# EAGLE design final (EAGLE 9.6.2)
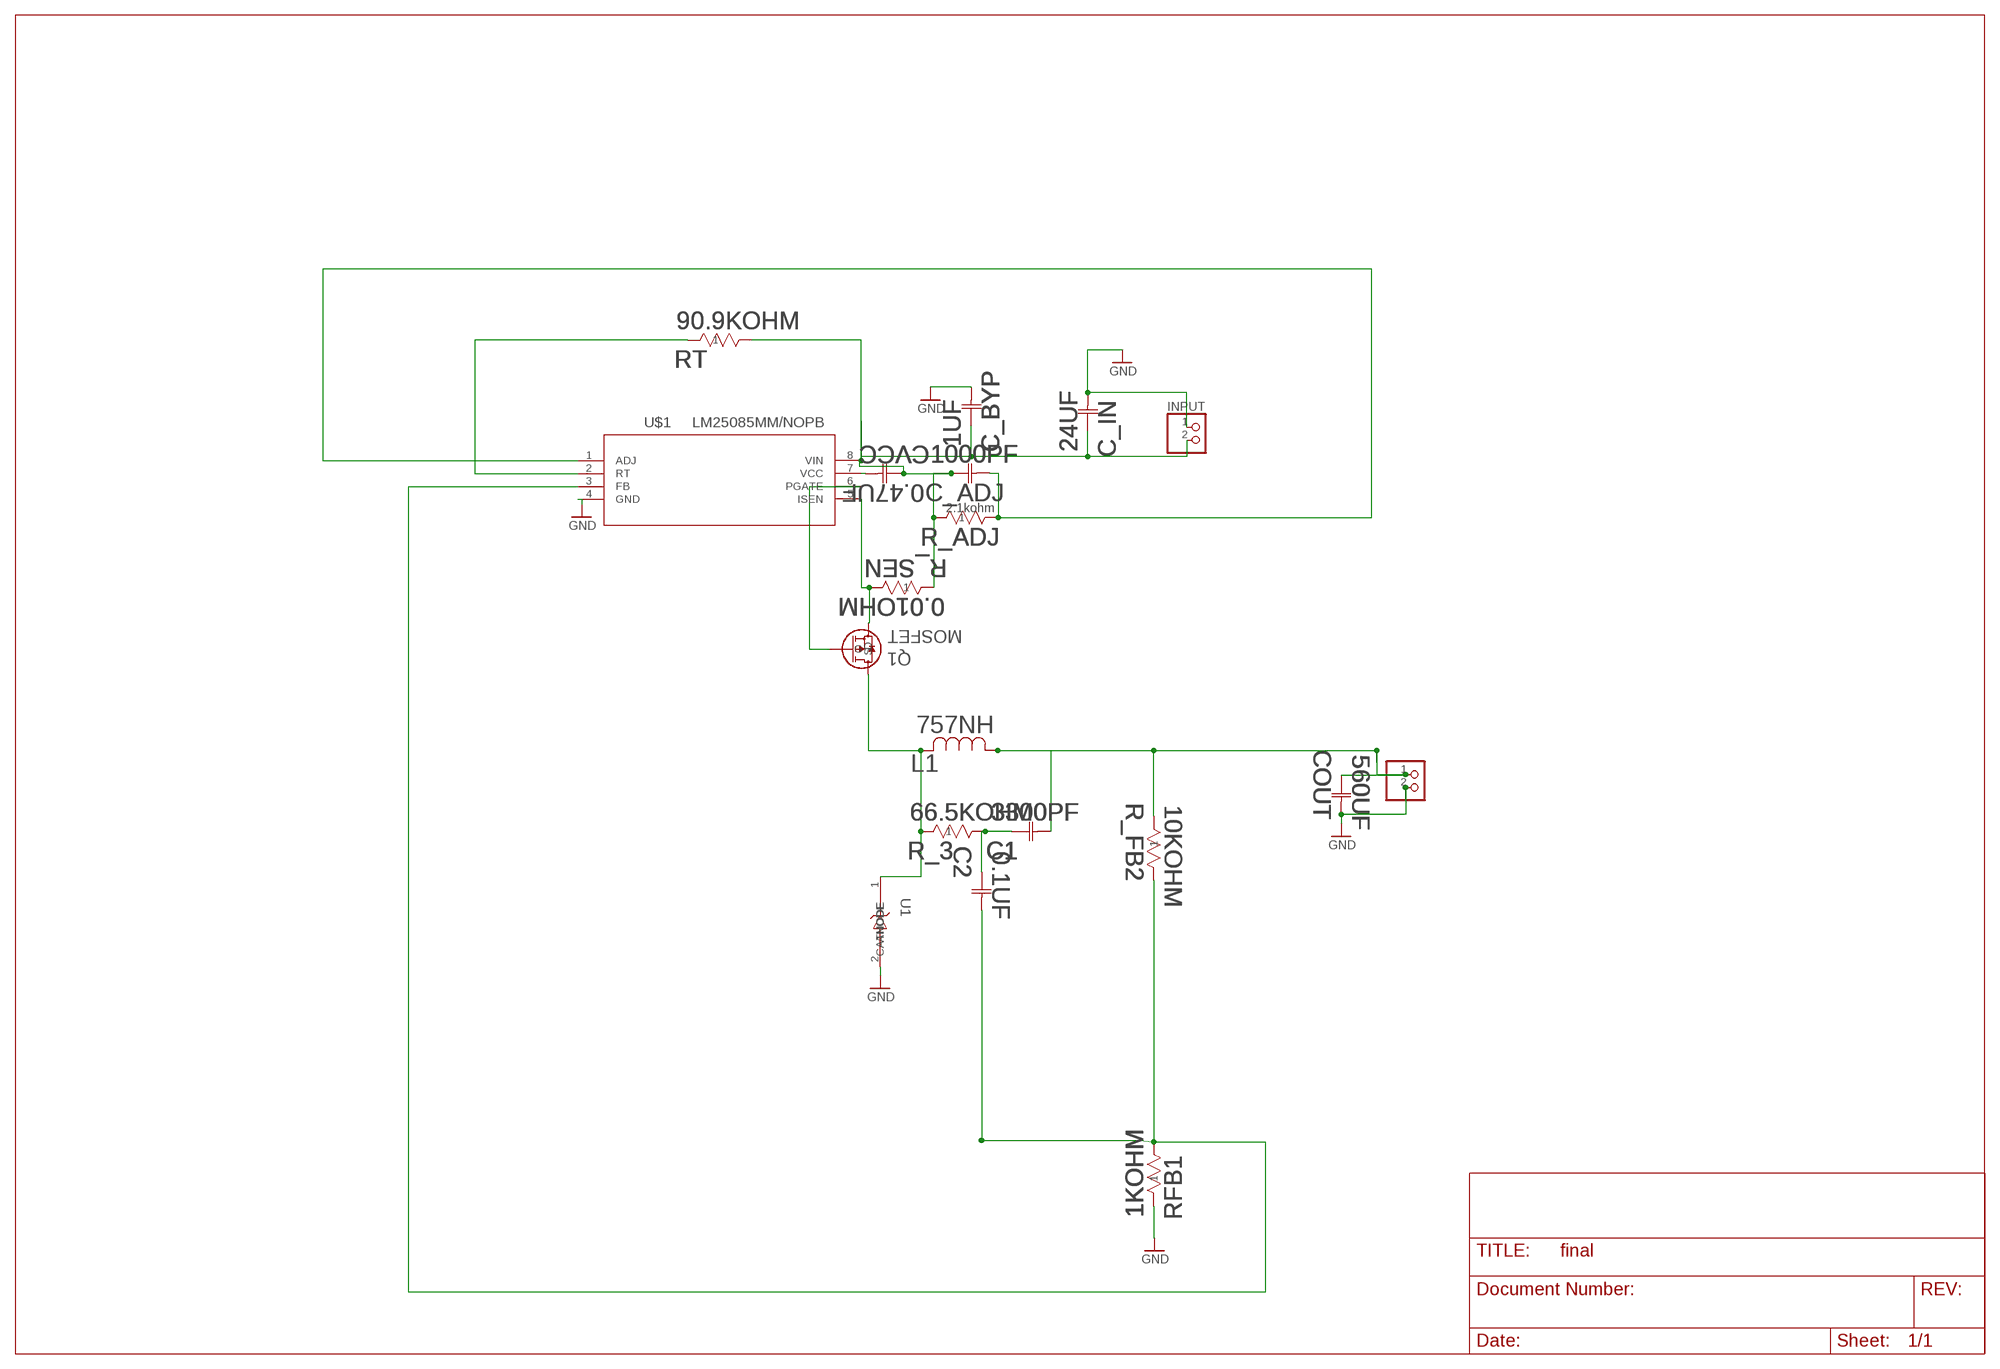
[diagram p0: schematic, sheet 1]

## Parts
0.01OHM  R_SEN  [STA_MPR5_STP]
0.1UF  C2  [U2-D_NCH]
0.47UF  CVCC  [CAP_WCAP-ATG8_05.0X11.0_WRE]
1KOHM  RFB1  [STA_CF14_STP]
1UF  C_BYP  [CAP_FG26_TDK]
2.1KOHM  R_ADJ  [STA_RNF14_STP]
10KOHM  R_FB2  [STA_CF14_STP]
24UF  C_IN  [CAP_5X11_WRE]
66.5KOHM  R_3  [RES_CMF50_VIS]
90.9KOHM  RT  [YAG_MF25_YAG]
560UF  COUT  [CAP_PAN_10X20_PAN]
757NH  L1  [IND_TAIYO_NRS6020_TAY]
1000PF  C_ADJ  [CAP_VY1_Y5U_9X5X13-10_VIS]
3300PF  C1  [G-21_MUR]
INPUT  PINHD-1X2  [1X02]
OUTPUT  PINHD-1X2  [1X02]
Q1  MOSFET  [SOT-23_DMP2123L_DIO]
U1  DIODE  [CASE_267-05_ONS]
U$1  LM25085MM/NOPB  [MUA08A]

## Nets
GND: 1KOHM.1 1UF.2 24UF.2 560UF.2 INPUT.1 OUTPUT.2 U1.2(ANODE) U$1.4(GND)
N$1: Q1.1(G) U$1.6(PGATE)
N$2: 0.1UF.2 1KOHM.2 10KOHM.2 U$1.3(FB)
N$3: 0.47UF.2 U$1.7(VCC)
N$4: 90.9KOHM.1 U$1.2(RT)
N$5: 2.1KOHM.2 1000PF.2 U$1.1(ADJ)
N$6: 0.01OHM.2 Q1.3(S) U$1.5(ISEN)
N$7: 0.01OHM.1 0.47UF.1 1UF.1 2.1KOHM.1 24UF.1 90.9KOHM.2 1000PF.1 INPUT.2 U$1.8(VIN)
N$9: 66.5KOHM.1 757NH.2 Q1.2(D) U1.1(CATHODE)
N$10: 0.1UF.1 66.5KOHM.2 3300PF.1
N$13: 10KOHM.1 560UF.1 757NH.1 3300PF.2 OUTPUT.1

## Notes on the sheet
- 2.1kohm

## Library data of the parts
0.01OHM = that library:R_SEN; COPYRIGHT: Copyright (C) 2023 Ultra Librarian. All rights reserved.; MANUFACTURER_PART_NUMBER: MPR5JB10L0; MFR_NAME: Stackpole International
0.1UF = that library:C2; COPYRIGHT: Copyright (C) 2023 Ultra Librarian. All rights reserved.; MANUFACTURER_PART_NUMBER: UCB1V0R1MCL1GS; MFR_NAME: Nichicon
0.47UF = that library:CVCC; COPYRIGHT: Copyright (C) 2023 Ultra Librarian. All rights reserved.; MANUFACTURER_PART_NUMBER: 860010672004; MFR_NAME: Wurth Electronics
1KOHM = that library:RFB1; COPYRIGHT: Copyright (C) 2023 Ultra Librarian. All rights reserved.; MANUFACTURER_PART_NUMBER: CF14JT1K00; MFR_NAME: Stackpole International
1UF = that library:C_BYP; COPYRIGHT: Copyright (C) 2023 Ultra Librarian. All rights reserved.; MANUFACTURER_PART_NUMBER: FG26X7R1E105KNT06; MFR_NAME: TDK
2.1KOHM = that library:R_ADJ; COPYRIGHT: Copyright (C) 2023 Ultra Librarian. All rights reserved.; MANUFACTURER_PART_NUMBER: RNF14FTD3K40; MFR_NAME: Stackpole International
10KOHM = that library:R_FB2; COPYRIGHT: Copyright (C) 2023 Ultra Librarian. All rights reserved.; MANUFACTURER_PART_NUMBER: CF14JT10K0; MFR_NAME: Stackpole International
24UF = that library:C_IN; COPYRIGHT: Copyright (C) 2023 Ultra Librarian. All rights reserved.; MANUFACTURER_PART_NUMBER: 860160472004; MFR_NAME: Wurth Electronics
66.5KOHM = that library:R_3; COPYRIGHT: Copyright (C) 2023 Ultra Librarian. All rights reserved.; MANUFACTURER_PART_NUMBER: CMF5066R500FHEB; MFR_NAME: Vishay
90.9KOHM = that library:RT; COPYRIGHT: Copyright (C) 2023 Ultra Librarian. All rights reserved.; MANUFACTURER_PART_NUMBER: MFR-25FBF52-90K9; MFR_NAME: Yageo
560UF = that library:COUT; COPYRIGHT: Copyright (C) 2023 Ultra Librarian. All rights reserved.; MANUFACTURER_PART_NUMBER: EEUFR1V561B; MFR_NAME: Panasonic
757NH = that library:L1; COPYRIGHT: Copyright (C) 2023 Ultra Librarian. All rights reserved.; MANUFACTURER_PART_NUMBER: NRS6020T0R8NMGG; MFR_NAME: Taiyo Yuden
1000PF = that library:C_ADJ; COPYRIGHT: Copyright (C) 2023 Ultra Librarian. All rights reserved.; MANUFACTURER_PART_NUMBER: VY1102M31Y5UC63V0; MFR_NAME: Vishay; TYPE: Ceramic Capacitors
3300PF = that library:C1; COPYRIGHT: Copyright (C) 2023 Ultra Librarian. All rights reserved.; MANUFACTURER_PART_NUMBER: GRM2165C1H332JA01D; MFR_NAME: Murata
INPUT OUTPUT = pinhead:PINHD-1X2: PIN HEADER
Q1 = that library:MOSFET; COPYRIGHT: Copyright (C) 2023 Ultra Librarian. All rights reserved.; MANUFACTURER_PART_NUMBER: DMP2123L-7; MFR_NAME: Diodes Inc
U1 = that library:DIODE; COPYRIGHT: Copyright (C) 2023 Ultra Librarian. All rights reserved.; MANUFACTURER_PART_NUMBER: 1N5406RLG; MFR_NAME: onsemi
U$1 = LM25085:LM25085MM/NOPB; COPYRIGHT: Copyright (C) 2023 Ultra Librarian. All rights reserved.; MANUFACTURER_PART_NUMBER: LM25085MM/NOPB; MFR_NAME: Texas Instruments

## Board
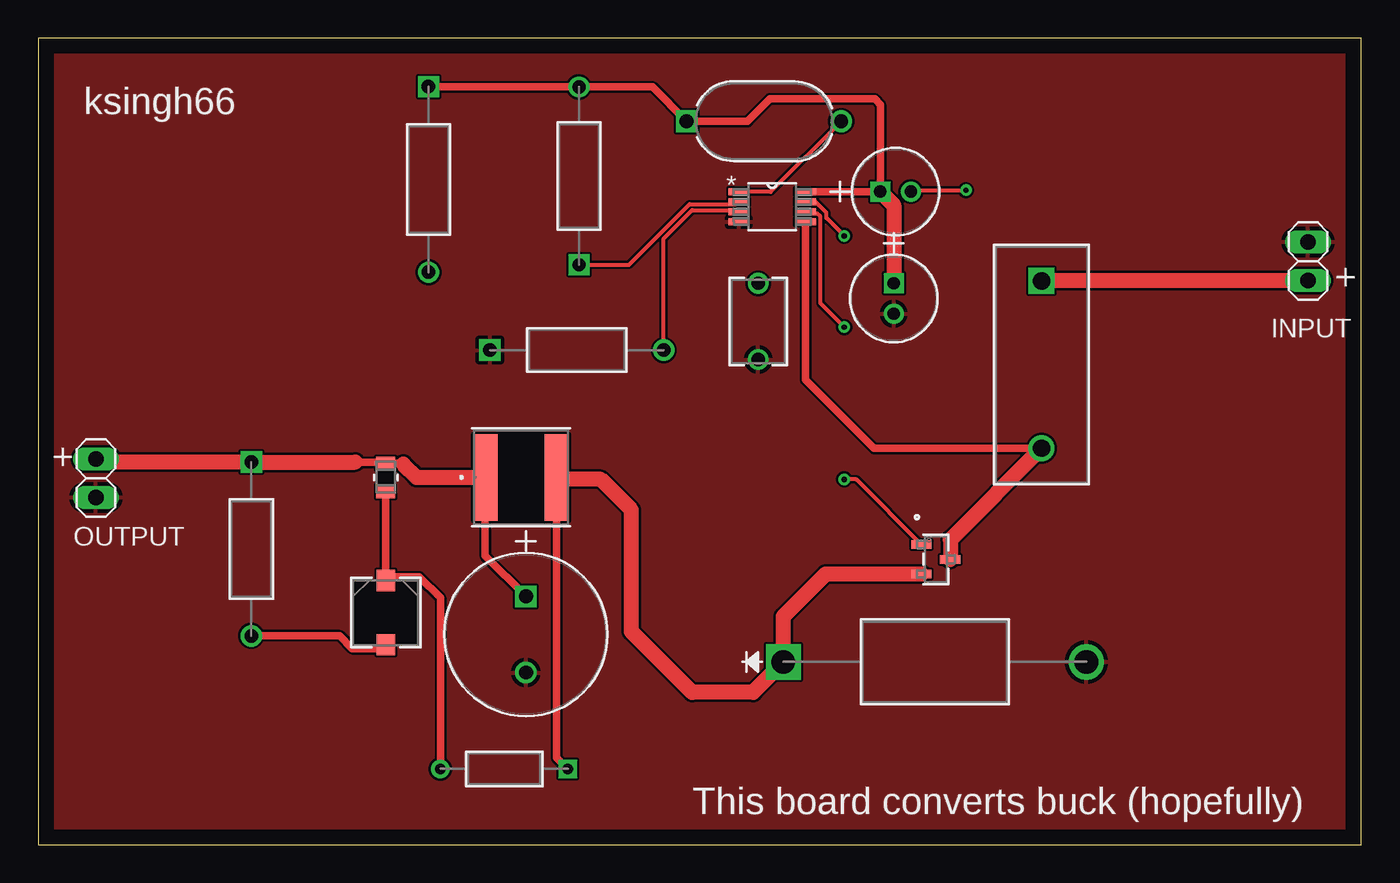
[diagram p1: board, top side]
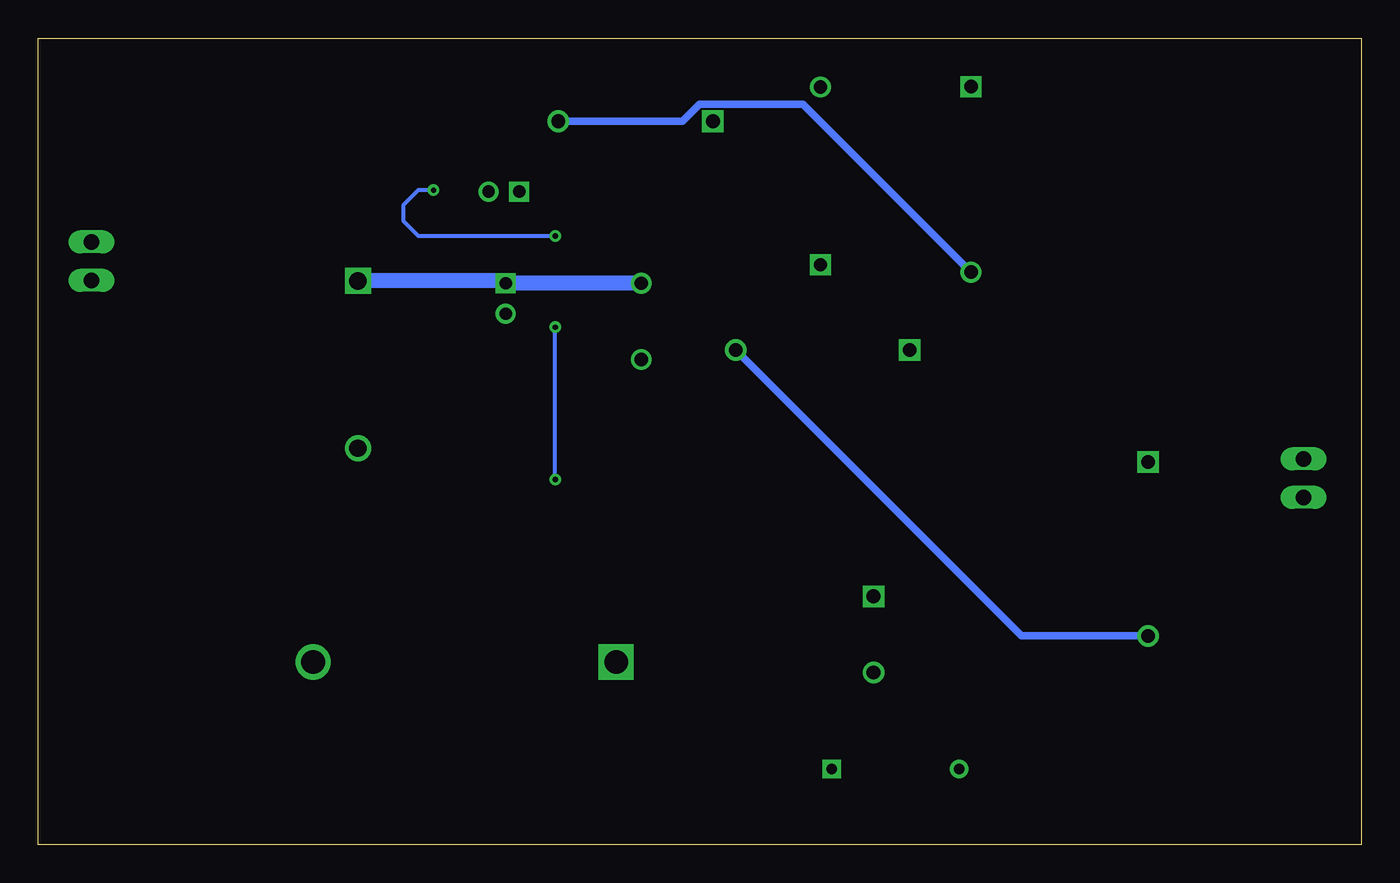
[diagram p2: board, bottom side, seen from below]

Size 87 x 53 mm. Coordinates in mm from the lower left corner, seen from the top.
Outline: 0,0 87,0 87,53 0,53 0,0
Copper layers (1*16): Top 0.035mm / dielectric 1.5mm / Bottom 0.035mm
Design rules "default": minimum track width 6mil, minimum drill 0.35mm, track to track 6mil, track to pad 6mil, pad to pad 6mil, via to via 6mil, smd to smd 6mil, copper to edge 40mil, drill to drill 6mil, minimum pad ring 10mil, minimum via ring 8mil, stop-mask expansion 4mil, vias tented up to drill 0mil, thermal gap 10mil

### Footprints (pad centres in the part's own frame; a part is rotated, then mirrored left to right if it is on the bottom)
STA_MPR5_STP = drill 1.143 pad 1.651 square: 1 0,0 | drill 1.143 pad 1.651: 2 10.998,0
U2-D_NCH = smd 1.397 x 1.219: 1 -2.108,0; 2 2.108,0
CAP_WCAP-ATG8_05.0X11.0_WRE = drill 0.813 pad 1.321 square: 1 0,0 | drill 0.813 pad 1.321: 2 2.007,0
STA_CF14_STP = drill 0.889 pad 1.397 square: 1 0,0 | drill 0.889 pad 1.397: 2 11.43,0
CAP_FG26_TDK = drill 0.864 pad 1.372: 1 0,0; 2 5.004,0
STA_RNF14_STP = drill 0.889 pad 1.397 square: 1 0,0 | drill 0.889 pad 1.397: 2 12.192,0
CAP_5X11_WRE = drill 0.813 pad 1.321 square: 1 0,0 | drill 0.813 pad 1.321: 2 2.007,0
RES_CMF50_VIS = drill 0.711 pad 1.219 square: 1 0,0 | drill 0.711 pad 1.219: 2 8.382,0
YAG_MF25_YAG = drill 0.864 pad 1.372 square: 1 0,0 | drill 0.864 pad 1.372: 2 11.684,0
CAP_PAN_10X20_PAN = drill 0.914 pad 1.422 square: 1 0,0 | drill 0.914 pad 1.422: 2 5.004,0
IND_TAIYO_NRS6020_TAY = smd 1.6 x 5.69: 1 -2.349,0; 2 2.349,0
CAP_VY1_Y5U_9X5X13-10_VIS = drill 0.914 pad 1.422 square: 1 -5.08,0 | drill 0.914 pad 1.422: 2 5.08,0
G-21_MUR = smd 0.864 x 1.245: 1 -0.927,0; 2 0.927,0
1X02 = drill 1.016 long: 1 -1.27,0; 2 1.27,0
SOT-23_DMP2123L_DIO = smd 0.559 x 1.321: 1 -0.958,-0.94; 2 0.958,-0.94; 3 0,0.94
CASE_267-05_ONS = drill 1.549 pad 2.057 square: 1 0,0 | drill 1.549 pad 2.057: 2 19.914,0
MUA08A = smd 1.372 x 0.457: 1 -2.197,0.975; 2 -2.197,0.325; 3 -2.197,-0.325; 4 -2.197,-0.975; 5 2.197,-0.975; 6 2.197,-0.325; 7 2.197,0.325; 8 2.197,0.975

### Placement (x,y rotation side)
0.01OHM  65.97,37.04 270 top
0.1UF  22.86,15.24 270 top
0.47UF  55.37,42.91 0 top
1KOHM  29.7,32.5 0 top
1UF  47.34,36.88 270 top
2.1KOHM  25.67,49.81 270 top
10KOHM  14.02,25.14 270 top
24UF  56.25,36.89 270 top
66.5KOHM  34.83,4.97 180 top
90.9KOHM  35.56,38.1 90 top
560UF  32.07,16.31 270 top
757NH  31.75,24.13 0 top
1000PF  47.72,47.53 0 top
3300PF  22.86,24.13 90 top
INPUT  83.48,38.34 270 top
OUTPUT  3.8,24.08 270 top
Q1  59.02,18.75 270 top
U1  49,12 0 top
U$1  48.26,41.91 0 top

### Tracks (layer width: path | path; a pad name or v marks a point on that pad's centre or on a via)
GND
  pour Top: 1.27,81.28 99.06,81.28 102.87,77.47 102.87,2.54 95.25,-5.08 0,-5.08 -2.54,-2.54 -2.54,77.47
N$1  (via drill 0.35)
  Top 0.25: Q1.1 53.79,24 v53,24 | U$1.6 50.58,41.46 51.24,41.46 51.42,41.28 51.42,35.58 v53,34
  Bottom 0.25: v53,24 v53,34
N$2
  Top 0.25: 1KOHM.2 41.13,39.82 43,41.69 45.96,41.69 U$1.3
  Top 0.5: 10KOHM.2 19.83,13.71 20.66,12.88 22.31,12.88 22.56,13.13 0.1UF.2
  Bottom 0.5: 10KOHM.2 22.35,13.71 1KOHM.2
N$3  (via drill 0.35)
  Top 0.25: v53,40 51.82,41.18 51.82,41.53 51.11,42.23 U$1.7 | 0.47UF.2 57.47,43 v61,43
  Bottom 0.25: v61,43 62,43 63,42 63,41 62,40 v53,40
N$4
  Top 0.25: 46,42.22 45.88,42.09 42.83,42.09 38.84,38.1 90.9KOHM.1
  Top 0.5: 46,42.22 46.04,42.22 U$1.2
N$5
  Top 0.25: 1000PF.2 48.16,42.88 U$1.1
  Bottom 0.5: 1000PF.2 44.63,47.53 43.52,48.64 36.7,48.64 2.1KOHM.2
N$6
  Top 0.5: U$1.5 50.46,30.54 54.96,26.04 0.01OHM.2
  Top 1: Q1.3 59.96,20.03 0.01OHM.2
N$7
  Top 0.5: U$1.8 55.35,42.88 0.47UF.1 55.37,48.63 55,49 48.11,49 46.64,47.53 1000PF.1 40.39,49.78 90.9KOHM.2 35.54,49.81 2.1KOHM.1
  Top 1: 1UF.1 47.36,36.89 | 0.47UF.1 56.25,42.03 24UF.1 | 0.01OHM.1 66,37.07 INPUT.2
  Bottom 1: 1UF.1 56.24,36.88 24UF.1 56.41,37.04 0.01OHM.1
N$9
  Top 0.5: 757NH.2 34.1,5.7 66.5KOHM.1
  Top 1: 757NH.2 34.23,24 37,24 39,22 39,14 43,10 47,10 U1.1 49,15 51.79,17.79 Q1.2
N$10
  Top 0.5: 3300PF.1 0.1UF.1 23.16,17.35 23.41,17.6 25.06,17.6 26.45,16.21 66.5KOHM.2
N$13
  Top 0.25: 22.8,25 3300PF.2
  Top 0.5: 757NH.1 29.4,18.98 560UF.1 | 20.86,25.14 22.66,25.14 22.8,25 | 3300PF.2 23.94,25.06 24,25
  Top 1: 14.1,25.06 10KOHM.1 | 10KOHM.1 4.01,25.14 OUTPUT.1 | 10KOHM.1 20.86,25.14 | 24,25 24.87,24.13 757NH.1

### Text on the board
tPlace: ksingh66 | + | + | This board converts buck (hopefully)